# Altium schematic sheet HT680.SchDoc
size A4; PageSetup: Record=PageOptions|CenterHorizontal=True|CenterVertical=True|PrintScale=0.96|XCorrection=1.00|YCorrection=1.00|PrintKind=0|BorderSize=5000000|LeftOffset=0|BottomOffset=0|Orientation=2|PaperLength=1000|PaperWidth=1000|Scale=100|PaperSource=7|PrintQuality=-4|MediaType=1|DitherType=10|PaperKind=A4|PrintScaleMode=1
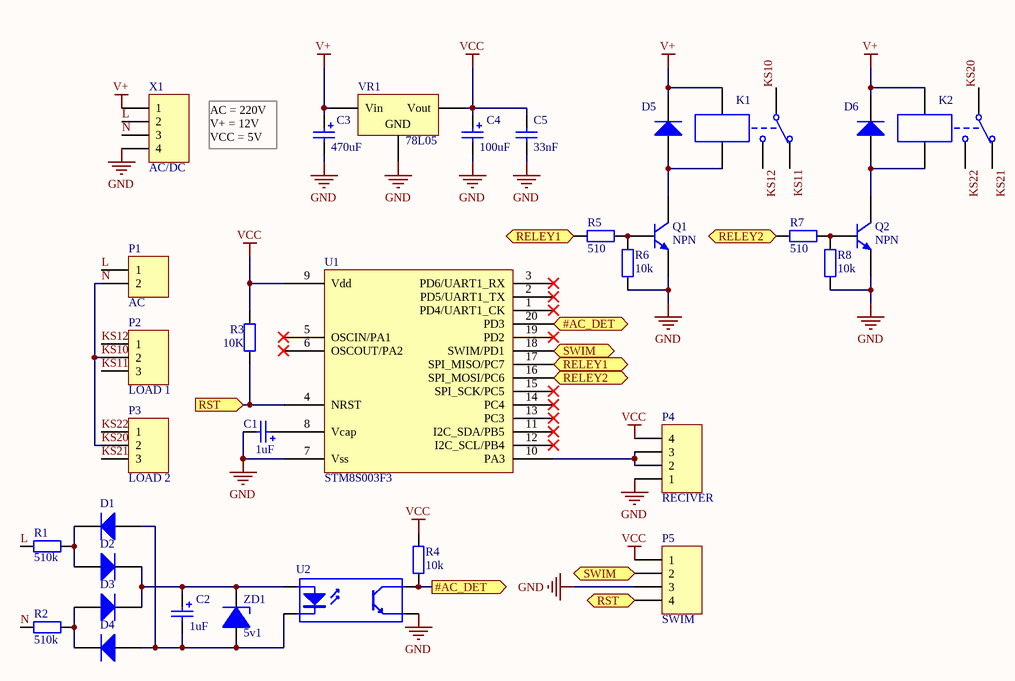
[diagram p0: HT680.SchDoc]

## Parts
C1  value 1uF  [Cap_elec_06x11]
C2  value 1uF  [Cap_elec_06x11]
C3  value 470uF  [Cap_elec_06x11]
C4  value 100uF  [Cap_elec_06x11]
C5  value 33nF  [C1206]
D1  (no value)  [DO-41]
D2  (no value)  [DO-41]
D3  (no value)  [DO-41]
D4  (no value)  [DO-41]
D5  (no value)  [DO-41]
D6  (no value)  [DO-41]
K1  (no value)  [Relay 19x15.5]
K2  (no value)  [Relay 19x15.5]
P1  AC  [DT-126RP]
P2  LOAD 1  [DT-126RP-03]
P3  LOAD 2  [DT-126RP-03]
P4  RECIVER  [HDR1X4]
P5  SWIM  [HDR1X4]
Q1  NPN  [SOT23-3]
Q2  NPN  [sot23-3]
R1  value 510k  [resistor1]
R2  value 510k  [resistor1]
R3  value 10K  [R1206]
R4  value 10k  [R1206]
R5  value 510  [R1206]
R6  value 10k  [R1206]
R7  value 510  [R1206]
R8  value 10k  [R1206]
U1  STM8S003F3  [TSSOP20]
U2  Optocoupler  [DIP-4 PC817]  (value not drawn)
VR1  78L05  [TO-92-Bent]
X1  AC/DC  [YFC-1057]
ZD1  5v1  [DO-35]

## Ports
#AC_DET (in), #AC_DET (out), RELEY1 (in), RELEY1 (out), RELEY2 (in), RELEY2 (out), RST (in), RST (out), SWIM

## Nets
GND: C1.2 C3.2 C4.2 C5.1 P4.1 P5.3 Q1.3(E) Q2.3(E) R6.1 R8.1 U1.7(Vss) U2.3(E) VR1.2(GND) X1.4
V+: C3.1 D5.2(K) D6.2(K) K1.4 K2.4 VR1.1(Vin) X1.1
VCC: C4.1 C5.2 P4.4 P5.1 R3.2 R4.2 U1.9(Vdd) VR1.3(Vout)
#AC_DET: R4.1 U1.20(PD3) U2.4(C) ; port #AC_DET
KS10: K1.1 K2.1 P1.2 P2.2 P3.2 R2.1 X1.3  [also labelled KS20, N]
KS11: K1.2 P2.3
KS12: K1.3 P2.1
KS21: K2.2 P3.3
KS22: K2.3 P3.1
L: P1.1 R1.1 X1.2
RELEY1: R5.1 U1.17(SPI_MISO/PC7) ; port RELEY1
RELEY2: R7.1 U1.16(SPI_MOSI/PC6) ; port RELEY2
RST: P5.4 R3.1 U1.4(NRST) ; port RST
SWIM: P5.2 U1.18(SWIM/PD1) ; port SWIM
NetC1_1: C1.1 U1.8(Vcap)
NetC2_1: C2.1 D2.2(K) D3.2(K) U2.1(A) ZD1.2
NetC2_2: C2.2 D1.1(A) D4.1(A) U2.2(K) ZD1.1
NetD1_2: D1.2(K) D2.1(A) R1.2
NetD3_1: D3.1(A) D4.2(K) R2.2
NetD5_1: D5.1(A) K1.5 Q1.1(C)
NetD6_1: D6.1(A) K2.5 Q2.1(C)
NetP4_2: P4.2 P4.3 U1.10(PA3)
NetQ1_2: Q1.2(B) R5.2 R6.2
NetQ2_2: Q2.2(B) R7.2 R8.2

Not connected (* = marked no-connect by the designer): U1 1(PD4/UART1_CK)* 2(PD5/UART1_TX)* 3(PD6/UART1_RX)* 5(OSCIN/PA1)* 6(OSCOUT/PA2)* 11(I2C_SDA/PB5)* 12(I2C_SCL/PB4)* 13(PC3)* 14(PC4)* 15(SPI_SCK/PC5)* 19(PD2)*

## Notes on the sheet
- AC = 220V
  V+ = 12V
  VCC = 5V

## Library data of the parts
C1-C4 = Cap Pol2: Polarized Capacitor (Axial); Published: 8-Jun-2000; LatestRevisionDate: 17-Jul-2002; LatestRevisionNote: Re-released for DXP Platform.; PackageReference: POLAR0.8; Publisher: Altium Limited; PackageDescription: Polarized Capacitor; 2 Leads
C5 = Cap: Capacitor; Published: 8-Jun-2000; LatestRevisionDate: 17-Jul-2002; LatestRevisionNote: Re-released for DXP Platform.; PackageReference: RAD-0.3; Publisher: Altium Limited; PackageDescription: Radial Cap, Thru-Hole; 2 Leads; 0.3 in Pin Spacing
D1-D6 = Diode: Default Diode; Published: 8-Jun-2000; LatestRevisionDate: 17-Jul-2002; LatestRevisionNote: Re-released for DXP Platform.; PackageVersion: Sep-1996; PackageReference: SMC; Publisher: Altium Limited; PackageDescription: DO-214-AB/SMC; 2 C-Bend Leads; Body 7.9 x 5.9 mm, inc. leads (LxW); Code_JEDEC: DO-214-AB
K1 K2 = Relay-SPDT: Single-Pole Dual-Throw Relay; Published: 24-Mar-1999; LatestRevisionDate: 17-Jul-2002; LatestRevisionNote: Re-released for DXP Platform.; PackageReference: MODULE5B; Publisher: Altium Limited
P1 = Header 2: Header, 2-Pin; LatestRevisionDate: 17-Jul-2002; LatestRevisionNote: Re-released for DXP Platform.; Publisher: Altium Limited
P2 P3 = Header 3: Header, 3-Pin; LatestRevisionDate: 17-Jul-2002; LatestRevisionNote: Re-released for DXP Platform.; Publisher: Altium Limited
P4 = Header 4: LatestRevisionDate: 17-Jul-2002; LatestRevisionNote: Re-released for DXP Platform.; Publisher: Altium Limited
P5 X1 = Header 4: Header, 4-Pin; LatestRevisionDate: 17-Jul-2002; LatestRevisionNote: Re-released for DXP Platform.; Publisher: Altium Limited
Q1 Q2 = NPN: NPN Bipolar Transistor; Published: 8-Jun-2000; LatestRevisionDate: 17-Jul-2002; LatestRevisionNote: Re-released for DXP Platform.; PackageReference: TO-226-AA; Publisher: Altium Limited; PackageDescription: TO, Flat Index; 3 In-Line, Axial Leads; Body Dia. 4.8mm; Leads 0.55 x 0.51 mm (max); Code_JEDEC: TO-226-AA
R1-R8 = Res2: Resistor; Published: 8-Jun-2000; LatestRevisionDate: 17-Jul-2002; LatestRevisionNote: Re-released for DXP Platform.; PackageReference: AXIAL-0.4; Publisher: Altium Limited; PackageDescription: Axial Device, Thru-Hole; 2 Leads; 0.4 in Pin Spacing
U1 = STM8S003F3_TSSOP20
U2 = Optoisolator1: 4-Pin Phototransistor Optocoupler; Published: 24-Mar-1999; LatestRevisionDate: 04-Mar-2005; LatestRevisionNote: Sch pins 3 & 4 Swapped.; DatasheetVersion: Nov-2003; PackageReference: DIP-4; Publisher: Altium Limited
VR1 = Volt Reg: Voltage Regulator; Published: 24-Mar-1999; LatestRevisionDate: 29-May-2009; LatestRevisionNote: IPC-7351 Footprint Added.; PackageReference: D2PAK; Publisher: Altium Limited; PackageDescription: 3-Pin Transistor Outline Package 2.54 mm Pitch, 15.1 mm Lead Span
ZD1 = Zener: Zenner diode